# EAGLE design Ploughmeter v2 (EAGLE 9.6.2)
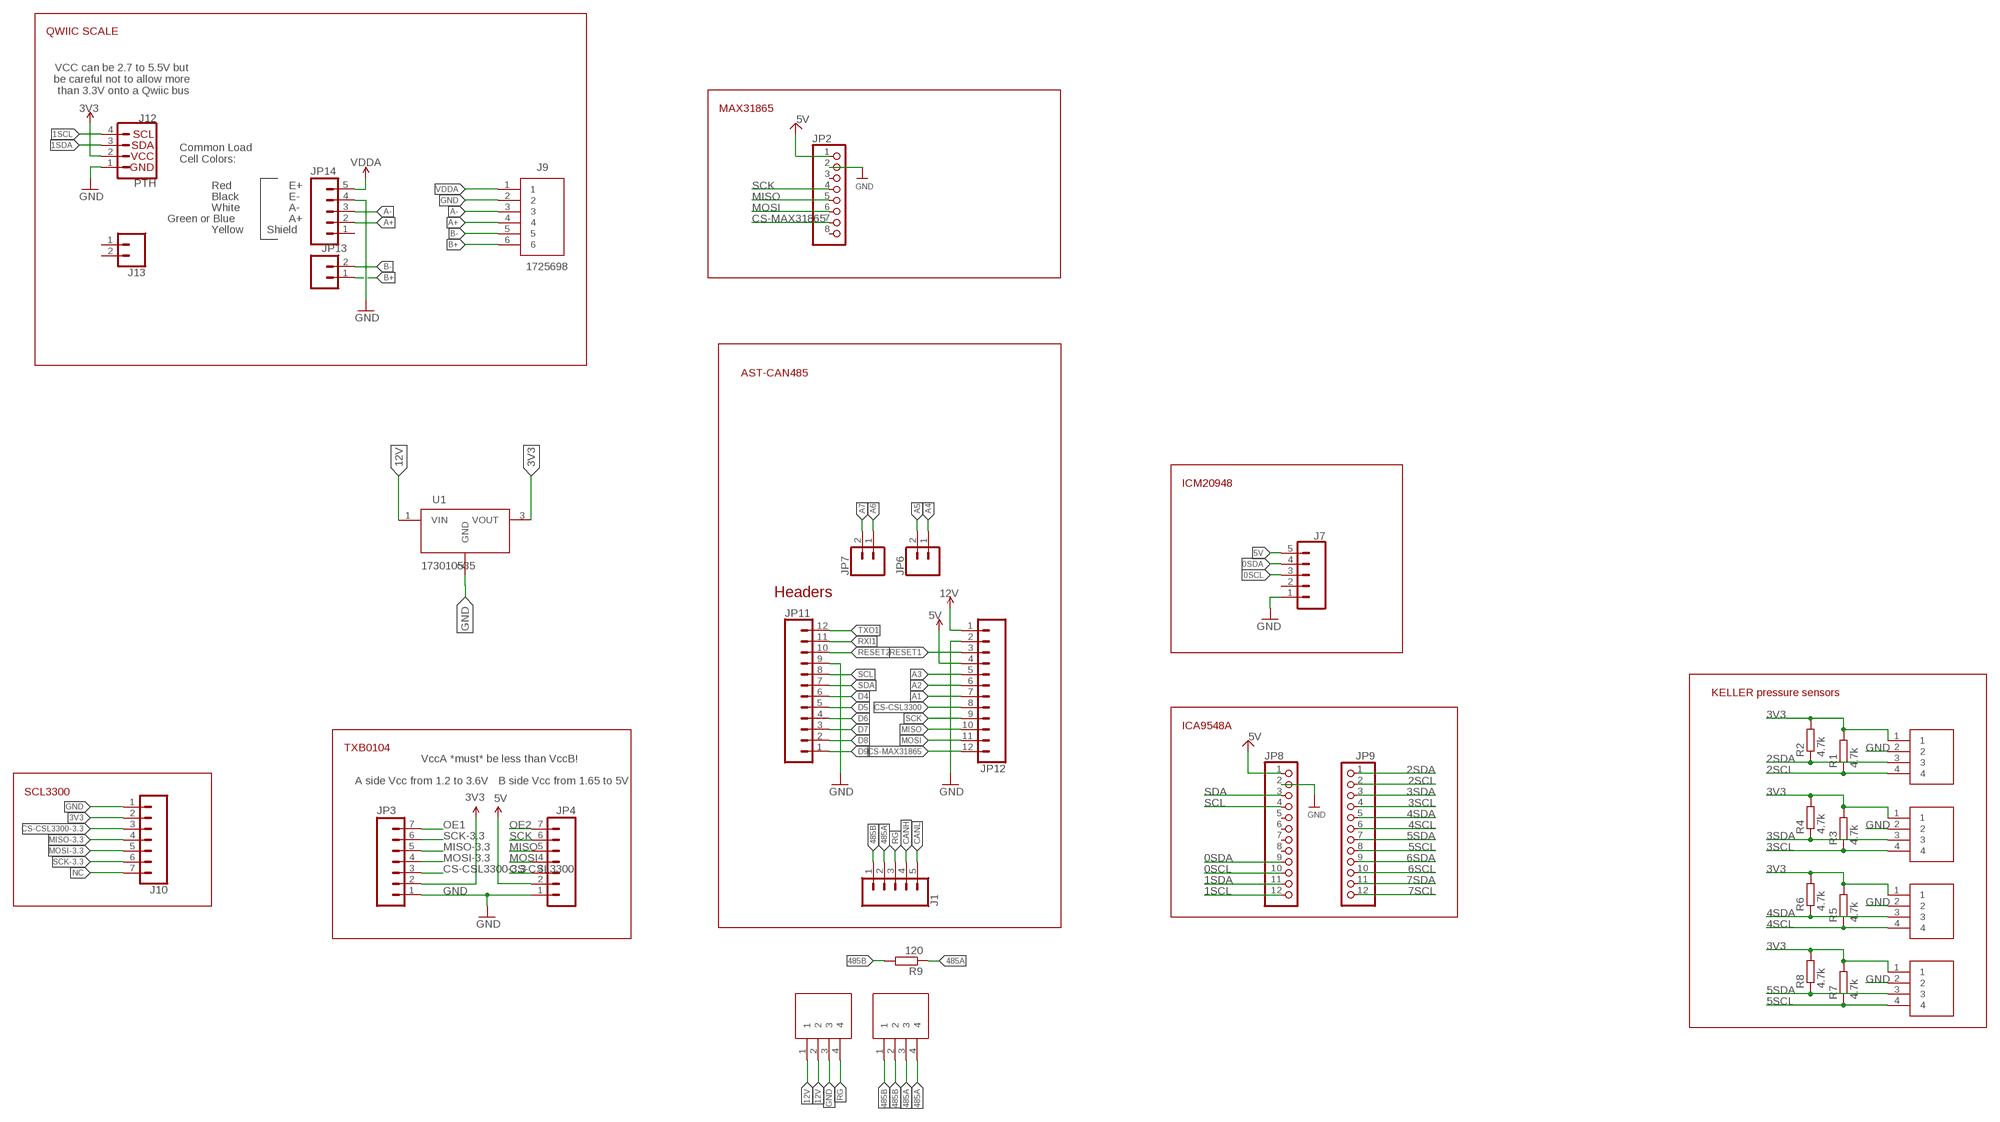
[diagram p0: schematic, sheet 1]

## Parts
J1  CONN_05NO_SILK  [1X05_NO_SILK]
J2  1725672  [1725672-4-2.54]
J3  1725672  [1725672-4-2.54]
J4  1725672  [1725672-4-2.54]
J5  1725672  [1725672-4-2.54]
J6  1725672  [1725672-4-2.54]
J7  CONN_05NO_SILK  [1X05_NO_SILK]
J8  1725672  [1725672-4-2.54]
J9  1725698  [SHDR6W90P0X254_1X6_1570X620X85]
J10  CONN_07  [1X07]
J12  PTH  I2C_STANDARD_NO_SILK  [1X04_NO_SILK]
J13  CONN_021X02_NO_SILK  [1X02_NO_SILK]
JP2  HEADER-1X870MIL  [1X08_ROUND_70]
JP3  M07  [1X07]
JP4  M07  [1X07]
JP6  CONN_021X02_NO_SILK  [1X02_NO_SILK]
JP7  CONN_021X02_NO_SILK  [1X02_NO_SILK]
JP8  HEADER-1X12  [1X12_ROUND]
JP9  HEADER-1X12  [1X12_ROUND]
JP11  CONN_12NO_SILK  [1X12_NO_SILK]
JP12  CONN_12NO_SILK  [1X12_NO_SILK]
JP13  CONN_021X02_NO_SILK  [1X02_NO_SILK]
JP14  CONN_05NO_SILK  [1X05_NO_SILK]
R1  4.7k  RESISTOR_R-EU_0309/10  [RESISTOR_0309/10]
R2  4.7k  RESISTOR_R-EU_0309/10  [RESISTOR_0309/10]
R3  4.7k  RESISTOR_R-EU_0309/10  [RESISTOR_0309/10]
R4  4.7k  RESISTOR_R-EU_0309/10  [RESISTOR_0309/10]
R5  4.7k  RESISTOR_R-EU_0309/10  [RESISTOR_0309/10]
R6  4.7k  RESISTOR_R-EU_0309/10  [RESISTOR_0309/10]
R7  4.7k  RESISTOR_R-EU_0309/10  [RESISTOR_0309/10]
R8  4.7k  RESISTOR_R-EU_0309/10  [RESISTOR_0309/10]
R9  120  RESISTOR_R-EU_0309/10  [RESISTOR_0309/10]
U1  173010535  [173010535]

## Nets
0SCL: J7.3 JP8.10
0SDA: J7.4 JP8.9
1SCL: J12.4 JP8.12
1SDA: J12.3 JP8.11
2SCL: J3.4 JP9.2 R1.1
2SDA: J3.3 JP9.1 R2.1
3SCL: J2.4 JP9.4 R3.1
3SDA: J2.3 JP9.3 R4.1
3V3: J2.1 J3.1 J4.1 J5.1 J10.2 J12.2 JP3.2 R1.2 R2.2 R3.2 R4.2 R5.2 R6.2 R7.2 R8.2 U1.3(VOUT) ; supply symbol labelled 3.3V
4SCL: J4.4 JP9.6 R5.1
4SDA: J4.3 JP9.5 R6.1
5SCL: J5.4 JP9.8 R7.1
5SDA: J5.3 JP9.7 R8.1
5V: J7.5 JP2.1 JP4.2 JP8.1 JP12.4 ; supply symbol labelled VCC, VIN
6SCL: JP9.10
6SDA: JP9.9
7SCL: JP9.12
7SDA: JP9.11
12V [vcc]: J6.1 J6.2 JP12.1 U1.1(VIN) ; supply symbol labelled VIN
485A: J1.2 J8.3 J8.4 R9.1
485B: J1.1 J8.1 J8.2 R9.2
A1: JP12.7
A2: JP12.6
A3: JP12.5
A4: JP6.1
A5: JP6.2
A6: JP7.1
A7: JP7.2
A+: J9.4 JP14.2
A-: J9.3 JP14.3
B+: J9.6 JP13.1
B-: J9.5 JP13.2
CANH: J1.4
CANL: J1.5
CS-CSL3300: JP4.3 JP12.8
CS-CSL3300-3.3: J10.3 JP3.3
CS-MAX31865: JP2.7 JP12.12
D4: JP11.6
D5: JP11.5
D6: JP11.4
D7: JP11.3
D8: JP11.2
D9: JP11.1
GND: J2.2 J3.2 J4.2 J5.2 J6.3 J7.1 J9.2 J10.1 J12.1 JP2.2 JP3.1 JP4.1 JP8.2 JP11.9 JP12.2 JP14.4 U1.2(GND)
MISO: JP2.5 JP4.5 JP12.10
MISO-3.3: J10.4 JP3.5
MOSI: JP2.6 JP4.4 JP12.11
MOSI-3.3: J10.5 JP3.4
NC: J10.7
OE1: JP3.7
OE2: JP4.7
RESET1: JP12.3
RESET2: JP11.10
RG: J1.3 J6.4
RXI1: JP11.11
SCK: JP2.4 JP4.6 JP12.9
SCK-3.3: J10.6 JP3.6
SCL: JP8.4 JP11.8
SDA: JP8.3 JP11.7
TXO1: JP11.12
VDDA: J9.1 JP14.5
Unconnected: J7.2 J13.1 J13.2 JP2.3 JP2.8 JP8.5 JP8.6 JP8.7 JP8.8 JP14.1

## Notes on the sheet
- QWIIC SCALE
- VCC can be 2.7 to 5.5V but 
  be careful not to allow more 
  than 3.3V onto a Qwiic bus
- MAX31865
- Common Load
  Cell Colors:
- Red | E+
- Black | E-
- White | A-
- Green or Blue | A+
- Yellow | Shield
- AST-CAN485
- ICM20948
- Headers
- KELLER pressure sensors
- ICA9548A
- TXB0104
- VccA *must* be less than VccB!
- A side Vcc from 1.2 to 3.6V | B side Vcc from 1.65 to 5V
- SCL3300

## Library data of the parts
J1 J7 JP14 = SparkFun-Connectors:CONN_05: Multi connection point. Often used as Generic Header-pin footprint for 0.1 inch spaced/style header connections On any of the 0.1 inch spaced packages, you can populate with these: Break Away Headers - Straight <https://www.sparkfun.com/products/116> (PRT-00116) Break Away Male Headers - Right Angle <https://www.sparkfun.com/products/553> (PRT-00553) Female Headers <https://www.sparkfun.com/products/115> (PRT-00115) Break Away Headers - Machine Pin <https://www.sparkfun.com/products/117> (PRT-00117) Break Away Female Headers - Swiss Machine Pin <https://www.sparkfun.com/products/743> (PRT-00743) For SCREWTERMINALS and SPRING TERMINALS visit here: Screw Terimnals on SparkFun.com <https://www.sparkfun.com/search/results?term=Screw+Terminals> (5mm/3.5mm/2.54mm spacing) This device is also useful as a general connection point to wire up your design to another part of your project. Our various solder wires solder well into these plated through hole pads. Hook-Up Wire - Assortment (Stranded, 22 AWG) <https://www.sparkfun.com/products/11375> (PRT-11375) Hook-Up Wire - Assortment (Solid Core, 22 AWG) <https://www.sparkfun.com/products/11367> (PRT-11367) View the entire wire category on our website here <https://www.sparkfun.com/categories/141> Special notes: Molex polarized connector foot print use with SKU : PRT-08231 with associated crimp pins and housings. 1MM SMD Version SKU: PRT-10208
J2-J6 J8 = Backplate_2:1725672: 4 way vertical PCB terminal,6A 63V Phoenix Contact Non-Fused Terminal Block, 4 Way, Solder Terminals, 26 ??? 20 AWG Through Hole, Nylon, 63 V Source: Datasheet <https://www.phoenixcontact.com/online/portal/us?uri=pxc-oc-itemdetail:pid=1725672&library=usen&tab=1.pdf>; ALLIED_NUMBER: 70054337; DESCRIPTION: 4 way vertical PCB terminal,6A 63V Phoenix Contact Non-Fused Terminal Block, 4 Way, Solder Terminals, 26 ??? 20 AWG Through Hole, Nylon, 63 V; HEIGHT: mm; MANUFACTURER_NAME: Phoenix Contact; MANUFACTURER_PART_NUMBER: 1725672; RS_PART_NUMBER: 3924476; RS_PRICE-STOCK: https://uk.rs-online.com/web/p/products/3924476
J9 = 1725698:1725698: 6 way PCB vertical mount terminal,2.54mm 6 way PCB vertical mount terminal,2.54mm Source: Datasheet; ALLIED_NUMBER: 70054339; DESCRIPTION: 6 way PCB vertical mount terminal,2.54mm 6 way PCB vertical mount terminal,2.54mm; HEIGHT: 8.5mm; MANUFACTURER_NAME: Phoenix Contact; MANUFACTURER_PART_NUMBER: 1725698; RS_PART_NUMBER: 3909045; RS_PRICE-STOCK: https://uk.rs-online.com/web/p/products/3909045
J10 = SparkFun-Connectors:CONN_07: Multi connection point. Often used as Generic Header-pin footprint for 0.1 inch spaced/style header connections On any of the 0.1 inch spaced packages, you can populate with these: Break Away Headers - Straight <https://www.sparkfun.com/products/116> (PRT-00116) Break Away Male Headers - Right Angle <https://www.sparkfun.com/products/553> (PRT-00553) Female Headers <https://www.sparkfun.com/products/115> (PRT-00115) Break Away Headers - Machine Pin <https://www.sparkfun.com/products/117> (PRT-00117) Break Away Female Headers - Swiss Machine Pin <https://www.sparkfun.com/products/743> (PRT-00743) For SCREWTERMINALS and SPRING TERMINALS visit here: Screw Terimnals on SparkFun.com <https://www.sparkfun.com/search/results?term=Screw+Terminals> (5mm/3.5mm/2.54mm spacing) This device is also useful as a general connection point to wire up your design to another part of your project. Our various solder wires solder well into these plated through hole pads. Hook-Up Wire - Assortment (Stranded, 22 AWG) <https://www.sparkfun.com/products/11375> (PRT-11375) Hook-Up Wire - Assortment (Solid Core, 22 AWG) <https://www.sparkfun.com/products/11367> (PRT-11367) View the entire wire category on our website here <https://www.sparkfun.com/categories/141> Special notes: Molex polarized connector foot print use with SKU : PRT-08231 with associated crimp pins and housings. 1MM SMD Version SKU: PRT-10208 NOTES ON THE VARIANTS LOCK and LOCK_LONGPADS... This footprint was designed to help hold the alignment of a through-hole component (i.e. 6-pin header) while soldering it into place. You may notice that each hole has been shifted either up or down by 0.005 of an inch from it's more standard position (which is a perfectly straight line). This slight alteration caused the pins (the squares in the middle) to touch the edges of the holes. Because they are alternating, it causes a "brace" to hold the component in place. 0.005 has proven to be the perfect amount of "off-center" position when using our standard breakaway headers. Although looks a little odd when you look at the bare footprint, once you have a header in there, the alteration is very hard to notice. Also,if you push a header all the way into place, it is covered up entirely on the bottom side.
J12 = SparkFun-Connectors:I2C_STANDARD: SparkFun I2C Standard Pinout Header SparkFun has standardized on a pinout for all I2C based sensor breakouts. This pinout allows I2C boards to be plugged directly into the headers on Arduino Uno compatible boards, and to be daisy chained easily. Example SparkFun Products: SparkFun Atmospheric Sensor Breakout - BME280 <https://www.sparkfun.com/products/13676> SparkFun Altitude/Pressure Sensor Breakout - MPL3115A2 <https://www.sparkfun.com/products/11084> SparkFun TOF Range Finder Sensor - VL6180 <https://www.sparkfun.com/products/12785>
J13 JP6 JP7 JP13 = SparkFun-Connectors:CONN_02: Multi connection point. Often used as Generic Header-pin footprint for 0.1 inch spaced/style header connections On any of the 0.1 inch spaced packages, you can populate with these: Break Away Headers - Straight <https://www.sparkfun.com/products/116> (PRT-00116) Break Away Male Headers - Right Angle <https://www.sparkfun.com/products/553> (PRT-00553) Female Headers <https://www.sparkfun.com/products/115> (PRT-00115) Break Away Headers - Machine Pin <https://www.sparkfun.com/products/117> (PRT-00117) Break Away Female Headers - Swiss Machine Pin <https://www.sparkfun.com/products/743> (PRT-00743) For SCREWTERMINALS and SPRING TERMINALS visit here: Screw Terimnals on SparkFun.com <https://www.sparkfun.com/search/results?term=Screw+Terminals> (5mm/3.5mm/2.54mm spacing) This device is also useful as a general connection point to wire up your design to another part of your project. Our various solder wires solder well into these plated through hole pads. Hook-Up Wire - Assortment (Stranded, 22 AWG) <https://www.sparkfun.com/products/11375> (PRT-11375) Hook-Up Wire - Assortment (Solid Core, 22 AWG) <https://www.sparkfun.com/products/11367> (PRT-11367) View the entire wire category on our website here <https://www.sparkfun.com/categories/141> Special notes: Molex polarized connector foot print use with: PRT-08233 with associated crimp pins and housings. 2.54_SCREWTERM for use with PRT-10571. 3.5mm Screw Terminal footprints for PRT-08084 5mm Screw Terminal footprints for use with PRT-08432
JP2 = microbuilder:HEADER-1X8: PIN HEADER
JP3 JP4 = SparkFun-Connectors:M07: Header 7 Standard 7-pin 0.1" header. Use with straight break away headers (SKU : PRT-00116), right angle break away headers (PRT-00553), swiss pins (PRT-00743), machine pins (PRT-00117), and female headers (PRT-00115). NOTES ON THE VARIANTS LOCK and LOCK_LONGPADS... This footprint was designed to help hold the alignment of a through-hole component (i.e. 7-pin header) while soldering it into place. You may notice that each hole has been shifted either up or down by 0.005 of an inch from it's more standard position (which is usually a perfectly straight line). This slight alteration caused the pins (the squares in the middle) to touch the edges of the holes. Because they are alternating, it causes a "brace" to hold the header in place. 0.005 has proven to be the perfect amount of "off-center" position when using our standard breakaway headers. Although looks a little odd when you look at the bare footprint, once you have a header in there, the alteration is very hard to notice. Also, if you push a header all the way into place, it is covered up entirely on the bottom side. This idea of altering the position of holes to aid alignment will be further integrated into the Sparkfun Library for other footprints. It can help hold any component with 3 or more connection pins.
JP8 JP9 = microbuilder:HEADER-1X12
JP11 JP12 = SparkFun-Connectors:CONN_12: Multi connection point. Often used as Generic Header-pin footprint for 0.1 inch spaced/style header connections On any of the 0.1 inch spaced packages, you can populate with these: Break Away Headers - Straight <https://www.sparkfun.com/products/116> (PRT-00116) Break Away Male Headers - Right Angle <https://www.sparkfun.com/products/553> (PRT-00553) Female Headers <https://www.sparkfun.com/products/115> (PRT-00115) Break Away Headers - Machine Pin <https://www.sparkfun.com/products/117> (PRT-00117) Break Away Female Headers - Swiss Machine Pin <https://www.sparkfun.com/products/743> (PRT-00743) For SCREWTERMINALS and SPRING TERMINALS visit here: Screw Terimnals on SparkFun.com <https://www.sparkfun.com/search/results?term=Screw+Terminals> (5mm/3.5mm/2.54mm spacing) This device is also useful as a general connection point to wire up your design to another part of your project. Our various solder wires solder well into these plated through hole pads. Hook-Up Wire - Assortment (Stranded, 22 AWG) <https://www.sparkfun.com/products/11375> (PRT-11375) Hook-Up Wire - Assortment (Solid Core, 22 AWG) <https://www.sparkfun.com/products/11367> (PRT-11367) View the entire wire category on our website here <https://www.sparkfun.com/categories/141> Special notes: Molex polarized connector foot print use with SKU : PRT-08231 with associated crimp pins and housings. 1MM SMD Version SKU: PRT-10208 NOTES ON THE VARIANTS LOCK and LOCK_LONGPADS... This footprint was designed to help hold the alignment of a through-hole component (i.e. 6-pin header) while soldering it into place. You may notice that each hole has been shifted either up or down by 0.005 of an inch from it's more standard position (which is a perfectly straight line). This slight alteration caused the pins (the squares in the middle) to touch the edges of the holes. Because they are alternating, it causes a "brace" to hold the component in place. 0.005 has proven to be the perfect amount of "off-center" position when using our standard breakaway headers. Although looks a little odd when you look at the bare footprint, once you have a header in there, the alteration is very hard to notice. Also,if you push a header all the way into place, it is covered up entirely on the bottom side.
R1-R9 = Lemming2_sensors:RESISTOR_R-EU_: RESISTOR, European symbol
U1 = DC-DC Converter:173010535: FDSM FIXED STEP DOWN REGULATOR M Manufacturer's datasheet <https://www.we-online.com/catalog/datasheet/173010335.pdf>; CREATED_BY: PCBLayout.com; DIGIKEY_PARTNO: 732-173010535-ND; MANUFACTURER: Würth Elektronik; MPN: 173010535

## Net classes
0 default: width 0.203 mm
1 vcc: width 0.254 mm
2 3.3V: width 0.508 mm

## Board
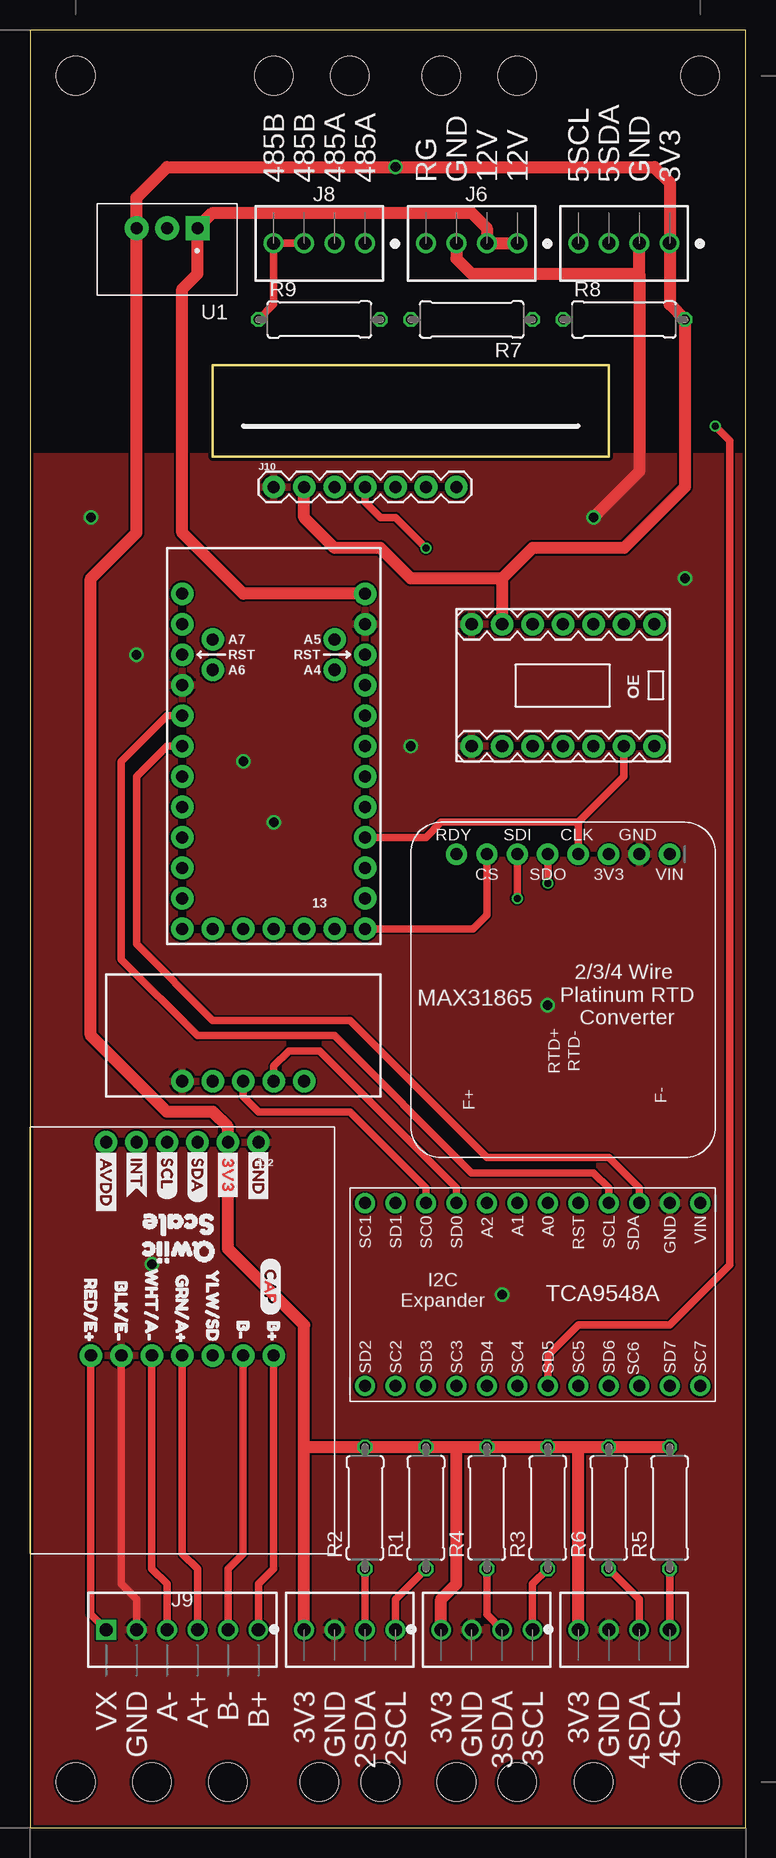
[diagram p1: board, top side]
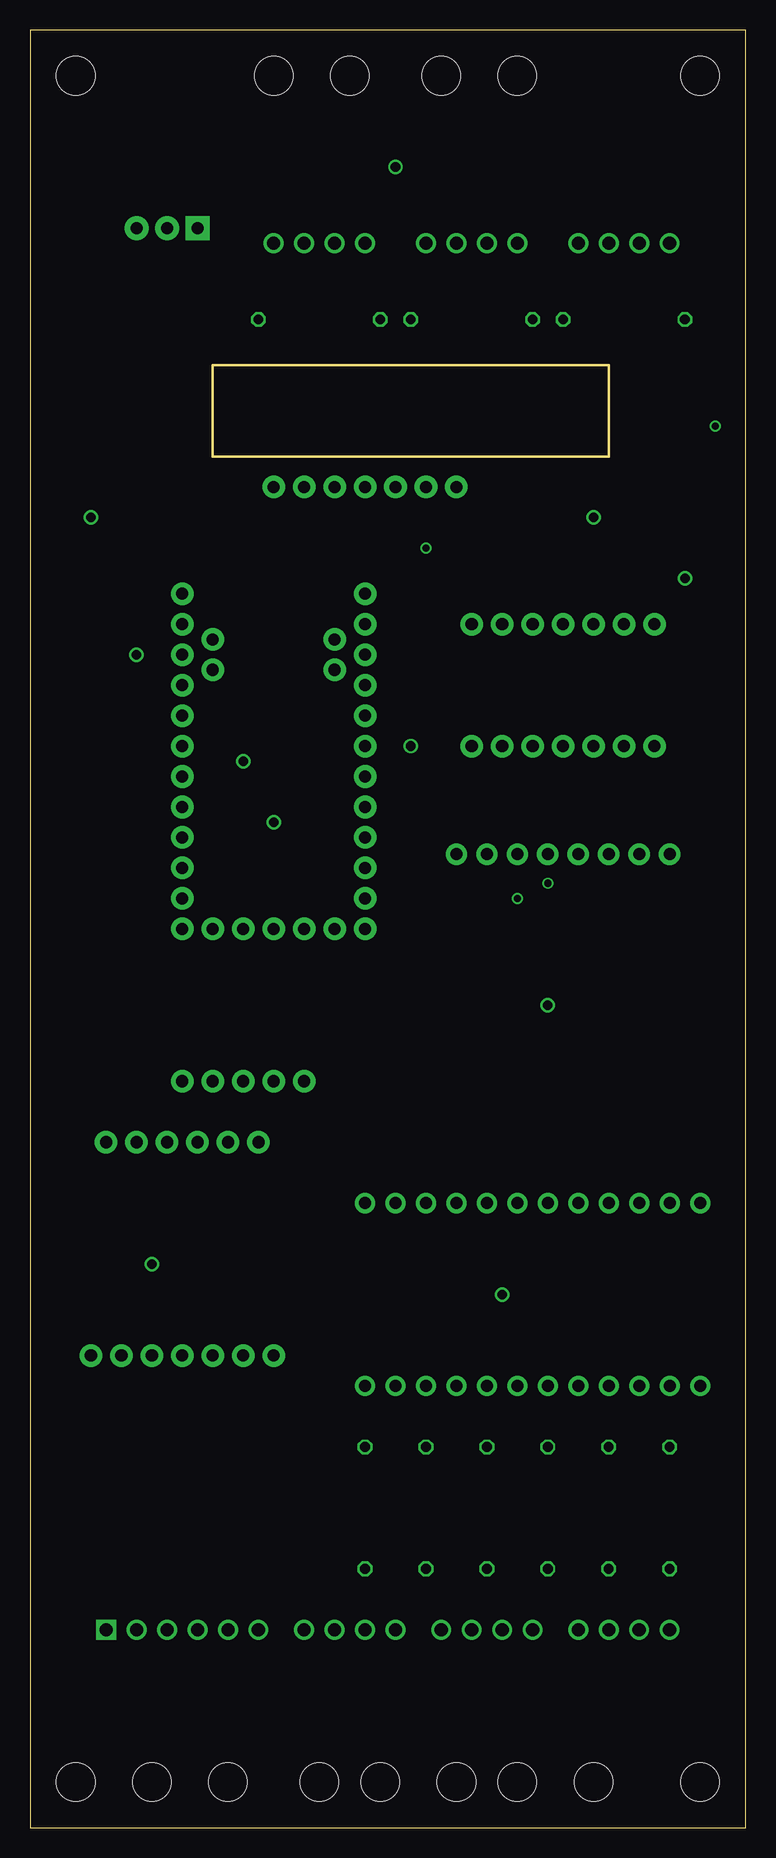
[diagram p2: board, inner layer Route2]
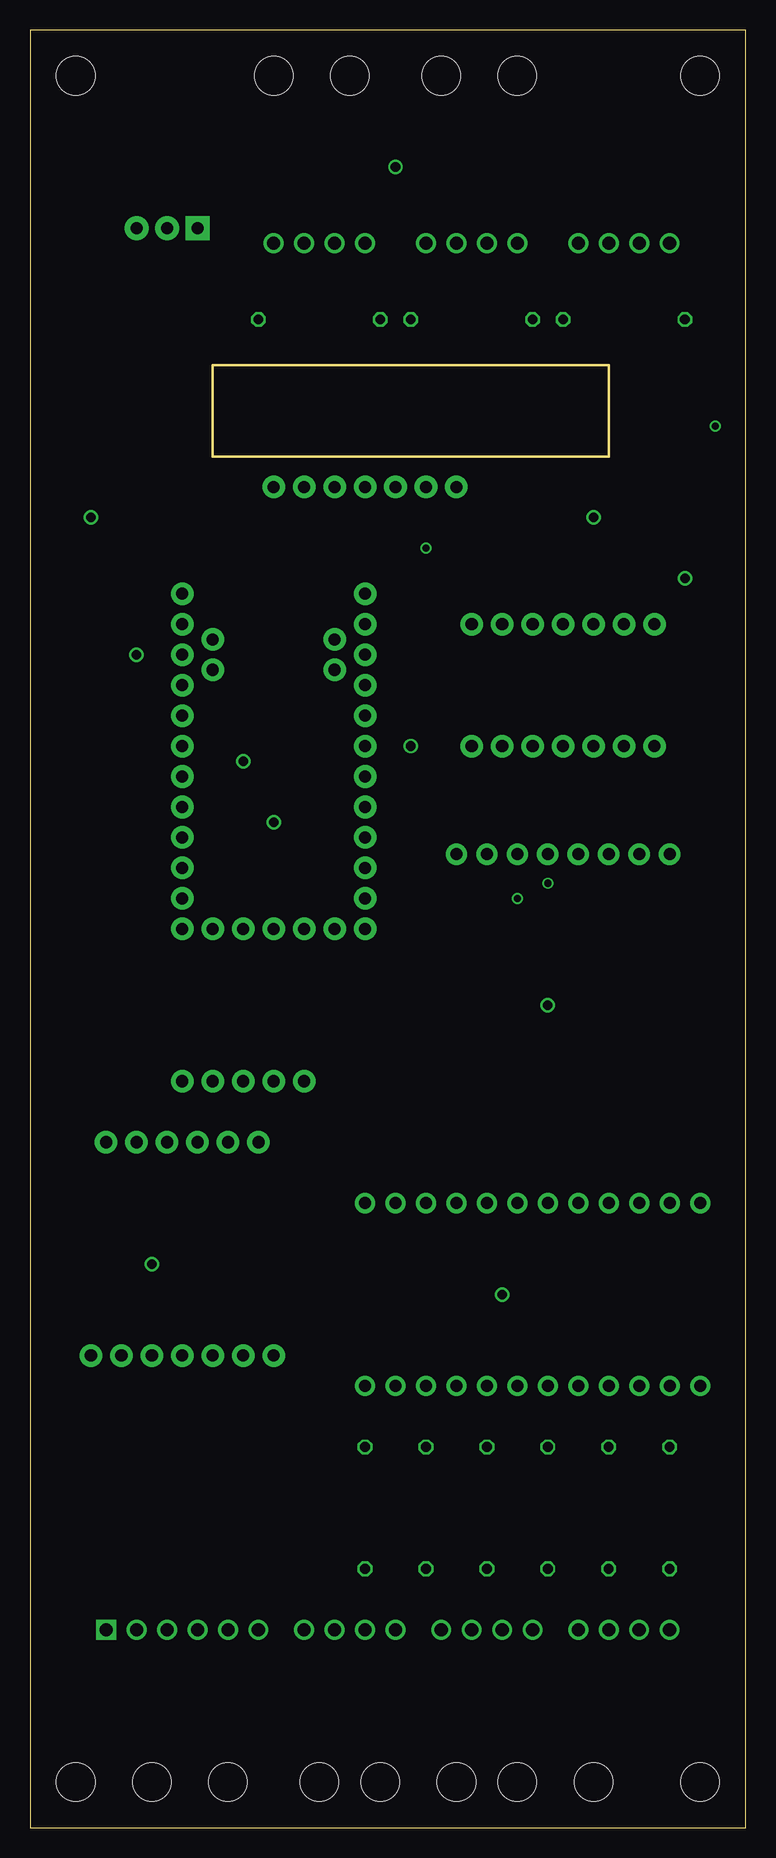
[diagram p3: board, inner layer Route15]
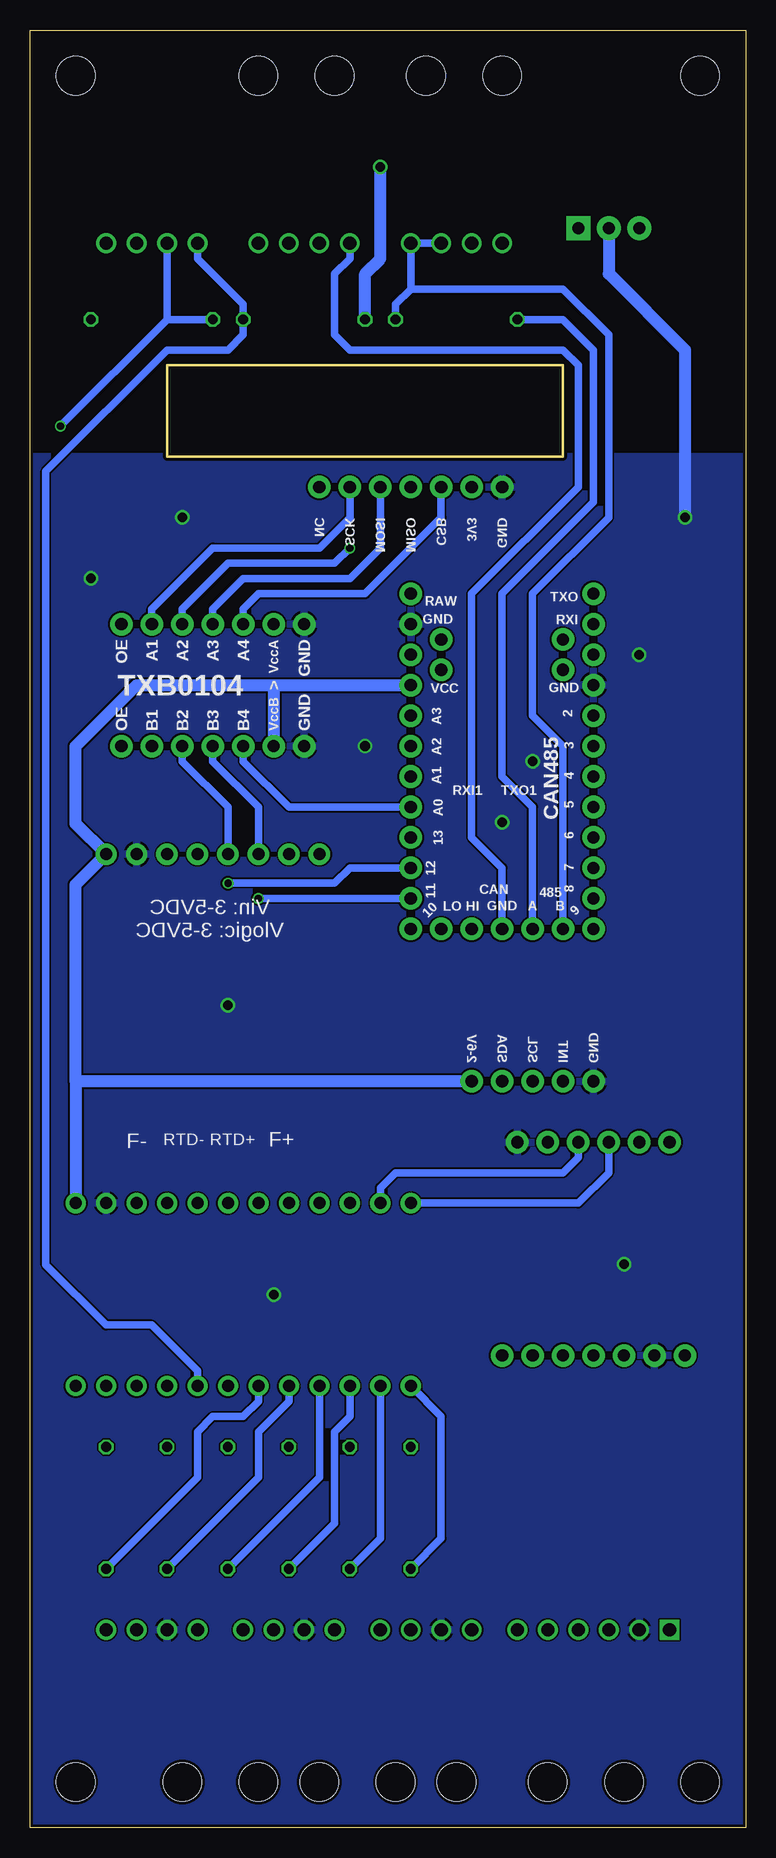
[diagram p4: board, bottom side, seen from below]

Size 59.69 x 149.86 mm. Coordinates in mm from the lower left corner, seen from the top.
Outline: 0,0 59.69,0 59.69,149.86 0,149.86 0,0
Outline: 15.24,114.3 48.26,114.3 48.26,121.92 15.24,121.92 15.24,114.3
Copper layers (1*16): Top 0.018mm / dielectric 1.55mm / Bottom 0.018mm
Design rules "eC_2Layer_PClass6_BaseCopperO18_eCDefault": minimum track width 0.15mm, minimum drill 0.35mm, track to track 0.15mm, track to pad 0.15mm, pad to pad 0.15mm, via to via 0.15mm, smd to smd 0mil, copper to edge 0.25mm, drill to drill 0.35mm, minimum pad ring 0.175mm, minimum via ring 0.125mm, stop-mask expansion 0mil, vias tented up to drill 0.45mm, thermal gap 0.2mm
Holes 3.2 mm at 3.81,146.05 55.88,146.05 3.81,3.81 55.88,3.81 20.32,146.05 26.67,146.05 34.29,146.05 40.64,146.05 10.16,3.81 16.51,3.81 24.13,3.81 29.21,3.81 35.56,3.81 40.64,3.81 46.99,3.81

### Footprints (pad centres in the part's own frame; a part is rotated, then mirrored left to right if it is on the bottom)
1X05_NO_SILK = drill 1.016 pad 1.88: 1 0,0; 2 2.54,0; 3 5.08,0; 4 7.62,0; 5 10.16,0
1725672-4-2.54 = drill 1.1 pad 1.65: 1 0,0; 2 2.54,0; 3 5.08,0; 4 7.62,0
SHDR6W90P0X254_1X6_1570X620X85 = drill 1.1 pad 1.65 square: 1 0,0 | drill 1.1 pad 1.65: 2 2.54,0; 3 5.08,0; 4 7.62,0; 5 10.16,0; 6 12.7,0
1X07 = drill 1.016 pad 1.88: 1 0,0; 2 2.54,0; 3 5.08,0; 4 7.62,0; 5 10.16,0; 6 12.7,0; 7 15.24,0
1X04_NO_SILK = drill 1.016 pad 1.88: 1 0,0; 2 2.54,0; 3 5.08,0; 4 7.62,0
1X02_NO_SILK = drill 1.016 pad 1.88: 1 0,0; 2 2.54,0
1X08_ROUND_70 = drill 1 pad 1.778: 1 -8.89,0; 2 -6.35,0; 3 -3.81,0; 4 -1.27,0; 5 1.27,0; 6 3.81,0; 7 6.35,0; 8 8.89,0
1X12_ROUND = drill 1 pad 1.676: 1 -13.97,0; 2 -11.43,0; 3 -8.89,0; 4 -6.35,0; 5 -3.81,0; 6 -1.27,0; 7 1.27,0; 8 3.81,0; 9 6.35,0; 10 8.89,0; 11 11.43,0; 12 13.97,0
1X12_NO_SILK = drill 1.016 pad 1.88: 1 0,0; 2 2.54,0; 3 5.08,0; 4 7.62,0; 5 10.16,0; 6 12.7,0; 7 15.24,0; 8 17.78,0; 9 20.32,0; 10 22.86,0; 11 25.4,0; 12 27.94,0
RESISTOR_0309/10 = drill 0.813 octagon: 1 -5.08,0; 2 5.08,0
173010535 = drill 1 pad 2 square: 1 -2.54,0 | drill 1 pad 2: 2 0,0; 3 2.54,0

### Placement (x,y rotation side)
J1  15.24,74.93 180 bottom
J2  34.29,16.51 0 top
J3  22.86,16.51 0 top
J4  45.72,16.51 0 top
J5  53.34,132.08 180 top
J6  40.64,132.08 180 top
J7  12.7,62.23 180 bottom
J8  27.94,132.08 180 top
J9  6.35,16.51 0 top
J10  20.32,111.76 0 top
J12  19.05,57.15 180 top
J13  6.35,57.15 0 top
JP2  44.45,81.15 180 top
JP3  36.83,100.33 0 top
JP4  36.83,90.17 0 top
JP6  25.4,96.52 90 top
JP7  15.24,96.52 90 top
JP8  41.91,52.07 180 top
JP9  41.91,36.83 0 top
JP11  12.7,74.93 90 top
JP12  27.94,102.87 270 top
JP13  20.32,39.37 180 top
JP14  15.24,39.37 180 top
R1  33.02,26.67 90 top
R2  27.94,26.67 90 top
R3  43.18,26.67 90 top
R4  38.1,26.67 90 top
R5  53.34,26.67 90 top
R6  48.26,26.67 90 top
R7  36.83,125.73 180 top
R8  49.53,125.73 0 top
R9  24.13,125.73 0 top
U1  11.43,133.35 180 top
U$10  [SDA-[)]  13.97,56.77 270 top
U$15  [SCL-[)]  11.43,56.77 270 top
U$16  [3V3-04]  16.51,56.77 270 top
U$18  [GND-04]  19.05,56.77 270 top
U$19  [B#11]  17.78,43.18 270 top
U$22  [B#12]  20.32,43.18 270 top
U$23  [BLK#E#1]  7.62,46.48 270 top
U$24  [GRN#A#4]  12.7,46.99 270 top
U$25  [RED#E#2]  5.08,46.74 270 top
U$26  [WHT#A#3]  10.16,47.5 270 top
U$27  [YLW#SD4]  15.24,47.37 270 top
U$28  [AVDD4]  6.35,56.77 270 top
U$29  [CAP0]  20.07,47.5 270 top
U$30  [QWIIC2]  16.89,48.01 180 top
U$31  [SCALE3]  16.89,50.29 180 top
U$32  [INT0]  8.89,56.77 270 top

### Tracks (layer width: path | path; a pad name or v marks a point on that pad's centre or on a via)
0SCL
  Top 0.61: JP8.10 33.02,53.34 26.67,59.69 19.05,59.69 17.78,60.96 J7.3
0SDA
  Top 0.61: JP8.9 35.56,53.34 24.13,64.77 21.59,64.77 20.32,63.5 J7.4
1SCL
  Bottom 0.61: J12.4 11.43,54.61 13.97,52.07 JP8.12
1SDA
  Bottom 0.61: J12.3 13.97,55.88 15.24,54.61 29.21,54.61 30.48,53.34 JP8.11
2SCL
  Top 0.61: J3.4 30.48,19.05 R1.1
  Bottom 0.61: R1.1 30.48,24.13 JP9.2
2SDA
  Top 0.61: J3.3 R2.1
  Bottom 0.61: R2.1 25.4,24.13 25.4,34.29 JP9.1
3SCL
  Top 0.61: J2.4 41.91,20.32 R3.1
  Bottom 0.61: JP9.4 35.56,29.21 R3.1
3SDA
  Top 0.61: R4.1 38.1,17.78 J2.3
  Bottom 0.61: R4.1 34.29,25.4 34.29,33.02 33.02,34.29 JP9.3
3V3  (via drill 0.8)
  Top 1.016: J3.1 22.86,31.75 | 22.86,31.75 R2.2 R1.2 35.56,31.75 | 22.86,31.75 22.86,41.91 16.51,48.26 J12.2 16.51,58.42 15.24,59.69 11.43,59.69 5.08,66.04 5.08,104.14 8.89,107.95 U1.3 8.89,135.89 11.43,138.43 v30.48,138.43 52.07,138.43 53.34,137.16 J5.1 53.34,127 R8.2 54.61,111.76 49.53,106.68 41.91,106.68 39.37,104.14 | 35.56,31.75 R4.2 R3.2 45.72,31.75 | 45.72,31.75 R6.2 R5.2 | J4.1 45.72,31.75 | J2.1 34.29,19.05 35.56,20.32 35.56,31.75 | 39.37,104.14 JP3.2 | 39.37,104.14 31.75,104.14 29.21,106.68 25.4,106.68 22.86,109.22 J10.2
  Bottom 1.016: v30.48,138.43 30.48,130.81 31.75,129.54 R7.2
4SCL
  Top 0.61: J4.4 R5.1
  Bottom 0.61: R5.1 45.72,29.21 45.72,33.02 44.45,34.29 41.91,34.29 40.64,35.56 JP9.6
4SDA
  Top 0.61: J4.3 50.8,19.05 R6.1
  Bottom 0.61: R6.1 40.64,29.21 40.64,33.02 38.1,35.56 JP9.5
5SCL
  Bottom 0.61: JP9.8 45.72,38.1 49.53,41.91 53.34,41.91 58.37,46.94 58.37,113.08 48.26,123.19 43.18,123.19 41.91,124.46 R7.1 41.91,127 45.72,130.81 J5.4
5SDA  (via drill 0.6)
  Top 0.61: JP9.7 43.18,39.37 45.72,41.91 53.34,41.91 58.37,46.94 58.37,115.62 v57.15,116.84
  Bottom 0.61: v57.15,116.84 48.26,125.73 | 48.26,125.73 R8.1 | J5.3 48.26,125.73
5V
  Bottom 1.016: J7.5 55.88,62.23 | 55.88,62.23 JP8.1 | 55.88,62.23 55.88,78.61 JP2.1 55.88,83.69 55.88,90.17 50.8,95.25 39.37,95.25 | 39.37,95.25 JP4.2 | 39.37,95.25 JP12.4
12V
  Top 1.016: JP12.1 17.78,102.87 12.7,107.95 12.7,128.27 13.97,129.54 U1.1 15.24,134.62 36.83,134.62 38.1,133.35 J6.2 J6.1
485A
  Top 0.61: R9.1 20.32,127 J8.4 J8.3
  Bottom 0.61: J1.2 17.78,85.09 20.32,87.63 20.32,102.87 12.7,110.49 12.7,123.19 15.24,125.73 R9.1
485B
  Bottom 0.61: J1.1 15.24,90.17 17.78,92.71 17.78,102.87 11.43,109.22 11.43,124.46 15.24,128.27 27.94,128.27 | J8.2 J8.1 27.94,128.27 | 27.94,128.27 29.21,127 R9.2
A+
  Top 0.61: J9.4 13.97,21.59 12.7,22.86 JP14.2
A-
  Top 0.61: J9.3 11.43,20.32 10.16,21.59 JP14.3
B+
  Top 0.61: J9.6 19.05,20.32 20.32,21.59 JP13.1
B-
  Top 0.61: J9.5 16.51,21.59 17.78,22.86 JP13.2
CS-CSL3300
  Bottom 0.61: JP4.3 41.91,88.9 38.1,85.09 JP12.8
CS-CSL3300-3.3
  Bottom 0.61: JP3.3 41.91,101.6 40.64,102.87 31.75,102.87 25.4,109.22 J10.3
CS-MAX31865
  Top 0.61: JP12.12 36.96,74.93 38.1,76.07 JP2.7
GND  (via drill 0.8)
  Top 0.61: J9.2 8.89,19.05 7.62,20.32 JP14.4
  Top 1.016: J6.3 35.56,130.81 36.83,129.54 50.8,129.54 | 50.8,129.54 J5.2 | 50.8,129.54 50.8,113.03 v46.99,109.22
  Bottom 1.016: U1.2 11.43,129.54 5.08,123.19 v5.08,109.22
  other vias: 8.89,97.79 31.75,90.17 54.61,104.14 43.18,68.58 39.37,44.45 10.16,46.99 17.78,88.9 20.32,83.82
  pour Route15 (isolate 0.305): 68.58,80.01 68.58,46.99 86.36,46.99 86.36,80.01
  pour Bottom: 0,0 0,114.3 59.69,114.3 59.69,0
  pour Top: -1.27,0 -1.27,114.3 59.69,114.3 59.69,0
MISO  (via drill 0.6)
  Top 0.61: v43.18,78.74 JP2.5
  Bottom 0.61: JP12.10 33.02,80.01 34.29,78.74 v43.18,78.74 | JP4.5 46.99,88.9 43.18,85.09 JP2.5
MISO-3.3  (via drill 0.6)
  Top 0.61: v33.02,106.68 30.48,109.22 29.21,109.22 27.94,110.49 J10.4
  Bottom 0.61: JP3.5 46.99,101.6 43.18,105.41 34.29,105.41 v33.02,106.68
MOSI  (via drill 0.6)
  Top 0.61: v40.64,77.47 JP2.6
  Bottom 0.61: JP12.11 v40.64,77.47 | JP2.6 40.64,85.09 44.45,88.9 JP4.4
MOSI-3.3
  Bottom 0.61: JP3.4 44.45,101.6 41.91,104.14 33.02,104.14 30.48,106.68 J10.5
RG
  Bottom 0.61: J1.3 20.32,80.01 22.86,82.55 22.86,102.87 13.97,111.76 13.97,121.92 15.24,123.19 33.02,123.19 34.29,124.46 34.29,129.54 33.02,130.81 J6.4
SCK
  Top 0.61: JP12.9 33.02,82.55 34.29,83.82 45.72,83.82 | 45.72,83.82 JP2.4 | 45.72,83.82 49.53,87.63 JP4.6
SCK-3.3
  Bottom 0.61: JP3.6 49.53,101.6 44.45,106.68 35.56,106.68 33.02,109.22 J10.6
SCL
  Top 0.61: JP8.4 48.26,53.34 46.99,54.61 36.83,54.61 25.4,66.04 13.97,66.04 7.62,72.39 7.62,88.9 11.43,92.71 JP11.8
SDA
  Top 0.61: JP11.7 11.43,90.17 8.89,87.63 8.89,73.66 15.24,67.31 26.67,67.31 38.1,55.88 48.26,55.88 50.8,53.34 JP8.3
VCC
  pour Route2 (isolate 0.305): 68.58,46.99 68.58,80.01 86.36,80.01 86.36,46.99
VDDA
  Top 0.61: J9.1 5.08,17.78 JP14.5

### Text on the board
Route2: 2
Route15: 3
tPlace: 485B | 485B | 485A | 485A | RG | GND | 12V | 12V | 5SCL | 5SDA | GND | 3V3 | A7 | A5 | RST | RST | A6 | A4 | OE | RDY | SDI | CLK | GND | CS | SDO | 3V3 | VIN | 13 | MAX31865 | 2/3/4 Wire / Platinum RTD / Converter | RTD+ | RTD- | F+ | F- | SC1 | SD1 | SC0 | SD0 | A2 | A1 | A0 | RST | SCL | SDA | GND | VIN | I2C / Expander | TCA9548A | SD2 | SC2 | SD3 | SC3 | SD4 | SC4 | SD5 | SC5 | SD6 | SC6 | SD7 | SC7 | VX | GND | A- | A+ | B- | B+ | 3V3 | GND | 2SDA | 2SCL | 3V3 | GND | 3SDA | 3SCL | 3V3 | GND | 4SDA | 4SCL
bPlace: GND | 3V3 | CSB | MISO | MOSI | SCK | NC | TXO | RAW | RXI | GND | GND | VccA | A4 | A3 | A2 | A1 | OE | GND | VCC | > | TXB0104 | 2 | A3 | 3 | CAN485 | GND | VccB | B4 | B3 | B2 | B1 | OE | A2 | 4 | A1 | 5 | TXO1 | RXI1 | A0 | 6 | 13 | 7 | 8 | 12 | 485 | CAN | HI | LO | 11 | 9 | B | A | GND | 10 | Vin: 3-5VDC / Vlogic: 3-5VDC | GND | INT | SCL | SDA | 2-6V | F+ | RTD+ | RTD- | F-